# Altium schematic sheet Power.SchDoc
size 406 x 304 mm; SheetNumber: 4; SheetTotal: 4
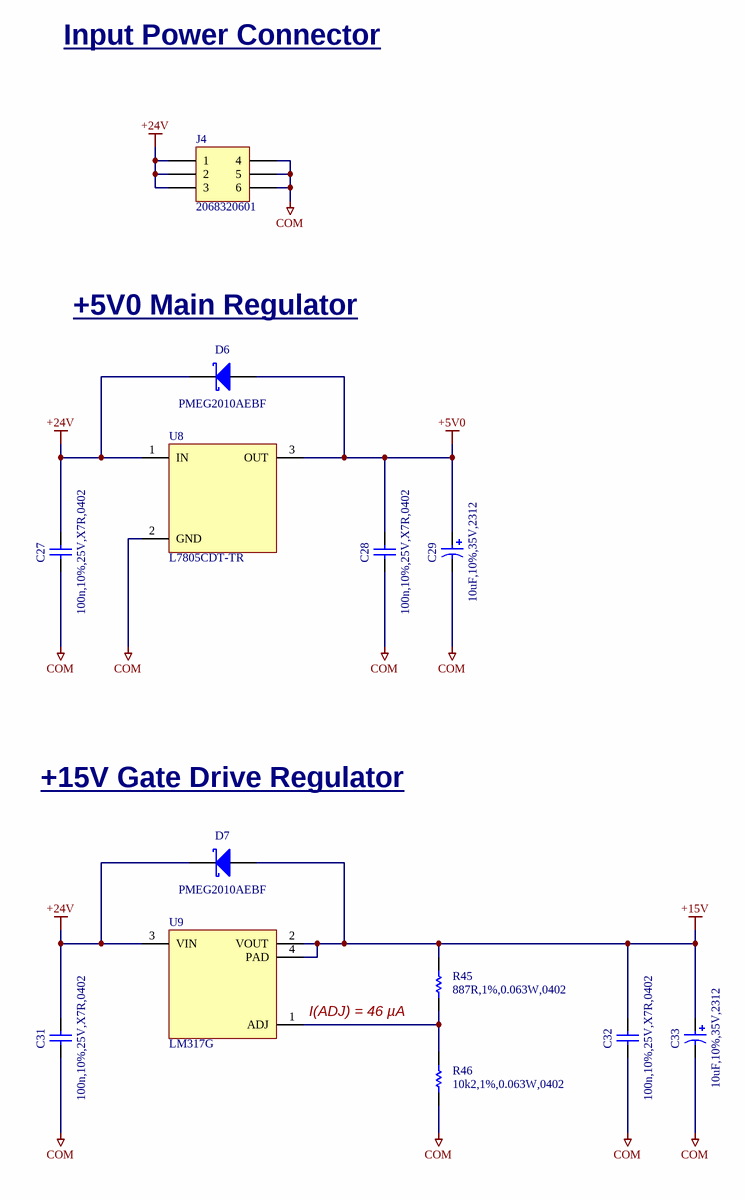
[diagram p0: Power.SchDoc]

## Parts
C27  100n,10%,25V,X7R,0402  [CAPC1005X06N]
C28  100n,10%,25V,X7R,0402  [CAPC1005X06N]
C29  10uF,10%,35V,2312  [KYOCERA_PKG_TAJC]
C31  100n,10%,25V,X7R,0402  [CAPC1005X06N]
C32  100n,10%,25V,X7R,0402  [CAPC1005X06N]
C33  10uF,10%,35V,2312  [KYOCERA_PKG_TAJC]
D6  PMEG2010AEBF  [NEXPERIA_PKG_SOD523]
D7  PMEG2010AEBF  [NEXPERIA_PKG_SOD523]
J4  2068320601  [MOLEX_2068320601]
R45  887R,1%,0.063W,0402  [RESC1005X04N]
R46  10k2,1%,0.063W,0402  [RESC1005X04N]
U8  L7805CDT-TR  [STMICRO_L7805CDT-TR]
U9  LM317G  [UMW_PKG_SOT223-3L]

## Nets
+5V0: C28.2 C29.1 D6.2(A) U8.3(OUT)
+15V: C32.2 C33.1 D7.2(A) R45.2 U9.2(VOUT) U9.4(PAD)
+24V: C27.2 C31.2 D6.1(K) D7.1(K) J4.1 J4.2 J4.3 U8.1(IN) U9.3(VIN)
COM: C27.1 C28.1 C29.2 C31.1 C32.1 C33.2 J4.4 J4.5 J4.6 R46.1 U8.2(GND)
NetR45_1: R45.1 R46.2 U9.1(ADJ)

## Notes on the sheet
- Input Power Connector
- +5V0 Main Regulator
- +15V Gate Drive Regulator
- I(ADJ) = 46 µA
- Rev
- Sheet Name:
- Date:
- Sheet
- Designer:
- of

## Library data of the parts
C27 C28 C31 C32 = CAP,Cer,100nF,10%,25V,X7R,0402: 0.1ï¿½F ï¿½10% 25V Ceramic Capacitor X7R 0402 (1005 Metric); Manufacturer 1: Murata Electronics; Manufacturer 1 Part Number: GRM155R71E104KE14J; Vendor 1 Part Number: 490-14603-1-ND; Vendor 1: DigiKey; Value: 100nF; Part Name: CAP,Cer,100nF,10%,25V,X7R,0402; CreatedBy: Judd Foster; HelpURL: https://search.murata.co.jp/Ceramy/image/img/A01X/G101/ENG/GRM155R71E104KE14-01.pdf
C29 C33 = CAP,Tant,10uF,10%,35V,2312: 10 ÂµF Molded Tantalum Capacitors 35 V 2312 (6032 Metric) 1.6Ohm; Manufacturer 1: KYOCERA AVX; Manufacturer 1 Part Number: TAJC106K035RNJ; Vendor 1 Part Number: 478-1701-1-ND; Vendor 1: DigiKey; Part Name: CAP,Tant,10uF,10%,35V,2312; CreatedBy: Judd Foster; HelpURL: https://datasheets.kyocera-avx.com/TAJ.pdf
D6 D7 = DIODE,Schottky,20V,1A,SOD523: Diode 20 V 1A Surface Mount SOD-523; Manufacturer 1: Nexperia USA Inc.; Vendor 1 Part Number: 1727-8539-1-ND; Vendor 1: DigiKey; Part Name: DIODE,Schottky,20V,1A,SOD523; CreatedBy: Judd Foster; HelpURL: https://assets.nexperia.com/documents/data-sheet/PMEG2010AEB.pdf; Manufacturer 1 Part Number: PMEG2010AEBF
J4 = Conn,Micro-Fit,Hdr,6Pos,Vert,Thru: Connector Header Through Hole 6 position 0.118" (3.00mm); Manufacturer 1: Molex; Vendor 1 Part Number: WM26556-ND; Vendor 1: DigiKey; Part Name: Conn,Micro-Fit,Hdr,6Pos,Vert,Thru; CreatedBy: Judd Foster; HelpURL: https://www.molex.com/en-us/products/part-detail/2068320601?display=pdf; Manufacturer 1 Part Number: 2068320601
R45 = RES,887R,1%,0.063W,0402: 887Î© 62.5mW 50V Â±200ppm/â„ƒ Â±1% Thick Film Resistors 0402 Chip Resistor - Surface Mount ROHS; Manufacturer 1: FH (Guangdong Fenghua Advanced Tech); Manufacturer 1 Part Number: RC-02W8870FT; Vendor 1 Part Number: C321640; Vendor 1: LCSC; Part Name: RES,887R,1%,0.063W,0402; CreatedBy: Judd Foster; HelpURL: https://www.lcsc.com/datasheet/lcsc_datasheet_2411220041_FH--Guangdong-Fenghua-Advanced-Tech-RC-02W8870FT_C321640.pdf
R46 = RES,10k2,1%,0.063W,0402: 10.2 kOhms Â±1% 0.063W, 1/16W Chip Resistor 0402 (1005 Metric) Moisture Resistant Thick Film; Manufacturer 1: YAGEO; Manufacturer 1 Part Number: RC0402FR-0710K2L; Vendor 1 Part Number: YAG2950CT-ND; Vendor 1: DigiKey; Part Name: RES,10k2,1%,0.063W,0402; CreatedBy: Judd Foster; HelpURL: https://www.yageo.com/upload/media/product/products/datasheet/rchip/PYu-RC_Group_51_RoHS_L_12.pdf; Value: 10k2
U8 = L7805CDT-TR: 62dB@(120Hz) 1.5A Fixed 5V Positive electrode 35V DPAK Voltage Regulators - Linear, Low Drop Out (LDO) Regulators ROHS; Manufacturer 1: STMicroelectronics; Vendor 1 Part Number: C310413; Vendor 1: LCSC; Part Name: L7805CDT-TR; CreatedBy: Judd Foster; HelpURL: https://lcsc.com/datasheet/lcsc_datasheet_2304140030_STMicroelectronics-L7805CDT-TR_C310413.pdf; Manufacturer 1 Part Number: L7805CDT-TR
U9 = LM317G: 75dB@(120Hz) 2.2A Adjustable 1.2V~37V Positive electrode 40V SOT-223 Voltage Regulators - Linear, Low Drop Out (LDO) Regulators ROHS; Manufacturer 1: UMW(Youtai Semiconductor Co., Ltd.); Vendor 1 Part Number: C347367; Vendor 1: LCSC; Part Name: LM317G; CreatedBy: Judd Foster; HelpURL: https://www.lcsc.com/datasheet/lcsc_datasheet_2411131159_UMW-Youtai-Semiconductor-Co---Ltd--LM317G_C347367.pdf; Manufacturer 1 Part Number: LM317G